# EAGLE design GW-RS485-V40-009 (EAGLE 7.6.0)
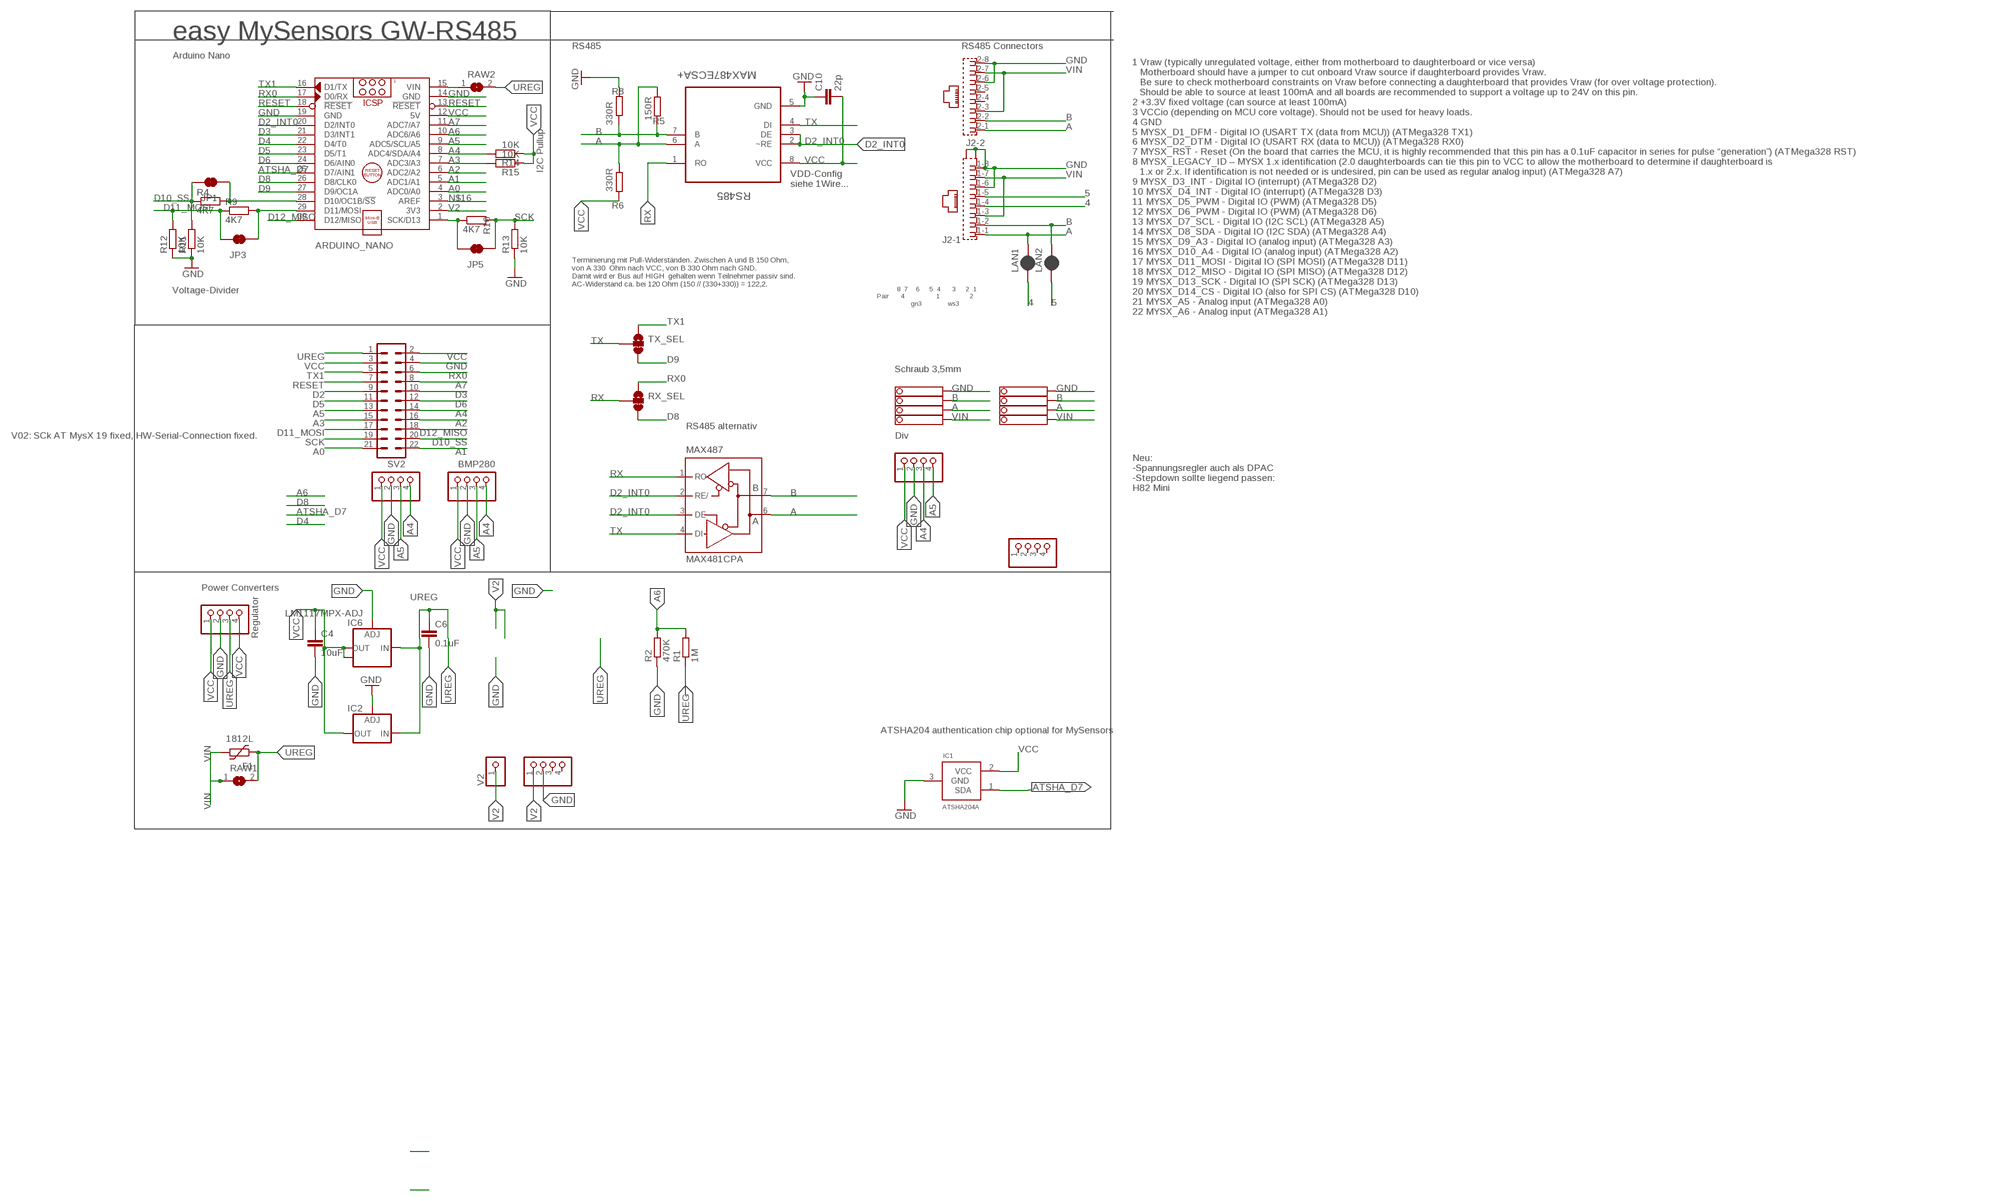
[diagram p0: schematic, sheet 1]

## Parts
ARDUINO_NANO  ARDUINO_NANO_OHNE-BOHR  [ARDUINO_NANO]
BH1750  PINHD-1X04_2.54-S  [1X04-S]
C4  10uF  C-EUC1210  [C1210]
C6  0.1uF  C-EUC1206  [C1206]
C10  22p  C-EUC0805  [C0805]
F1  1812L  [1812L]
I2C-1  PINHD-1X04_2.54-S  [1X04-S]
I2C-2  PINHD-1X04_2.54-S  [1X04-S]
IC1  ATSHA204A  [SOT23]
IC2  LD117ADT50TR  [DPACK]
IC6  LM1117MPX-ADJ  [SOT223]
J2  RJ45_2X_NARROW_SHILDPINS_NOCASE  [RJ45_2X_NARROW_SHILDPINS_NOCASE]
JP1  JUMPER-SMT_2_NC_TRACE_SILK  [SMT-JUMPER_2_NC_TRACE_SILK]
JP2  PINHD-1X04_2.54-S  [1X04-S]
JP3  JUMPER-SMT_2_NC_TRACE_SILK  [SMT-JUMPER_2_NC_TRACE_SILK]
JP5  JUMPER-SMT_2_NC_TRACE_SILK  [SMT-JUMPER_2_NC_TRACE_SILK]
LAN1  JUMPER-SMT_2_NC_PASTE_SILK  [SMT-JUMPER_2_NC_PASTE_SILK]
LAN2  JUMPER-SMT_2_NC_PASTE_SILK  [SMT-JUMPER_2_NC_PASTE_SILK]
MAX487  MAX481CPA  [DIL08]
R1  1M  R-EU_R0805  [R0805]
R2  470K  R-EU_R0805  [R0805]
R4  4K7  R-EU_M0805  [M0805]
R5  150R  R-EU_R0805  [R0805]
R6  330R  R-EU_R0805  [R0805]
R8  330R  R-EU_R0805  [R0805]
R9  4K7  R-EU_M0805  [M0805]
R10  4K7  R-EU_M0805  [M0805]
R11  10K  R-EU_M0805  [M0805]
R12  10K  R-EU_M0805  [M0805]
R13  10K  R-EU_M0805  [M0805]
R14  10K  R-EU_R0805  [R0805]
R15  10K  R-EU_R0805  [R0805]
RAW1  SJ  [SJ]
RAW2  SJ  [SJ]
RS485  MAX487ECSA+  [SOIC127P600X175-8N]
RX_SEL  JUMPER-SMT_3_1-NC_TRACE_SILK  [SMT-JUMPER_3_1-NC_TRACE_SILK]
STEPDWN  PINHD-1X04_2.54-S  [1X04-S]
SV2  MA11-2  [MA11-2]
TX_SEL  JUMPER-SMT_3_1-NC_TRACE_SILK  [SMT-JUMPER_3_1-NC_TRACE_SILK]
V2  PINHD-1X1  [1X01]
V2-  PINHD-1X04_2.54-S  [1X04-S]
X1  1751264  [1751264]
X4  1751264  [1751264]

## Nets
4: J2.1-4 LAN1.1
5: J2.1-5 LAN2.1
A: J2.1-1 J2.2-1 LAN1.2 MAX487.6(A) R5.1 R6.2 RS485.6(A) X1.2 X4.2
A0: ARDUINO_NANO.4(ADC0/A0) SV2.21
A1: ARDUINO_NANO.5(ADC1/A1) SV2.22
A2: ARDUINO_NANO.6(ADC2/A2) SV2.16
A3: ARDUINO_NANO.7(ADC3/A3) R15.2 SV2.15
A4: ARDUINO_NANO.8(ADC4/SDA/A4) BH1750.4 I2C-1.4 I2C-2.3 R14.2 SV2.14
A5: ARDUINO_NANO.9(ADC5/SCL/A5) BH1750.3 I2C-1.3 I2C-2.4 SV2.13
A6: ARDUINO_NANO.10(ADC6/A6) R1.2 R2.2
A7: ARDUINO_NANO.11(ADC7/A7) SV2.8
ATSHA_D7: ARDUINO_NANO.25(D7/AIN1) IC1.1(SDA)
B: J2.1-2 J2.2-2 LAN2.2 MAX487.7(B) R5.2 R8.1 RS485.7(B) X1.3 X4.3
D2: SV2.9
D2_INT0: ARDUINO_NANO.20(D2/INT0) MAX487.2(RE/) MAX487.3(DE) RS485.2(~RE) RS485.3(DE)
D3: ARDUINO_NANO.21(D3/INT1) SV2.10
D4: ARDUINO_NANO.22(D4/T0)
D5: ARDUINO_NANO.23(D5/T1) SV2.11
D6: ARDUINO_NANO.24(D6/AIN0) SV2.12
D8: ARDUINO_NANO.26(D8/CLK0) RX_SEL.3
D9: ARDUINO_NANO.27(D9/OC1A) TX_SEL.3
D10_SS: JP1.1 R4.1 R11.2 SV2.20
D11_MOSI: JP3.1 R9.1 R12.2 SV2.17
D12_MISO: ARDUINO_NANO.30(D12/MISO) SV2.18
GND [Power]: ARDUINO_NANO.14(GND) ARDUINO_NANO.19(GND) BH1750.2 C4.2 C6.2 C10.1 I2C-1.2 I2C-2.2 IC1.3(GND) IC2.1(ADJ) IC6.1(ADJ) J2.1-6 J2.1-8 J2.2-6 J2.2-8 J2.G1(-1:S1) J2.G3(-1:S2) R2.1 R8.2 R11.1 R12.1 R13.1 RS485.5(GND) STEPDWN.2 SV2.4 V2-.2 X1.4 X4.4
N$5: ARDUINO_NANO.1(SCK/D13) JP5.1 R10.1
N$8: ARDUINO_NANO.28(D10/OC1B/!SS) JP1.2 R4.2
N$9: ARDUINO_NANO.29(D11/MOSI) JP3.2 R9.2
N$16: ARDUINO_NANO.3(AREF)
RAW1 [Power]: ARDUINO_NANO.15(VIN) RAW2.1
RESET: ARDUINO_NANO.13(!RESET) ARDUINO_NANO.18(!RESET) SV2.7
RX: MAX487.1(RO) RS485.1(RO) RX_SEL.2
RX0: ARDUINO_NANO.17(D0/RX) RX_SEL.1 SV2.6
SCK: JP5.2 R10.2 R13.2 SV2.19
TX: MAX487.4(DI) RS485.4(DI) TX_SEL.2
TX1: ARDUINO_NANO.16(D1/TX) SV2.5 TX_SEL.1
UREG [Power]: C6.1 F1.P$1 IC2.3(IN) IC6.3(IN) R1.1 RAW1.2 RAW2.2 STEPDWN.3 SV2.1
V2 [Power]: ARDUINO_NANO.2(3V3) V2-.1 V2.1
VCC [Power]: ARDUINO_NANO.12(5V) BH1750.1 C4.1 C10.2 I2C-1.1 I2C-2.1 IC1.2(VCC) IC2.4(OUT) IC6.2(OUT) IC6.TAB(OUT1) R6.1 R14.1 R15.1 RS485.8(VCC) STEPDWN.1 STEPDWN.4 SV2.2 SV2.3
VIN [Power]: F1.P$2 J2.1-3 J2.1-7 J2.2-3 J2.2-7 RAW1.1 X1.1 X4.1
Unconnected: J2.2-4 J2.2-5 JP2.1 JP2.2 JP2.3 JP2.4 V2-.3 V2-.4

## Notes on the sheet
- easy MySensors GW-RS485
- RS485 | RS485 Connectors
- Arduino Nano
- I2C Pullup
- VDD-Config
  siehe 1Wire...
- Voltage-Divider
- Terminierung mit Pull-Widerständen. Zwischen A und B 150 Ohm,
  von A 330  Ohm nach VCC, von B 330 Ohm nach GND. 
  Damit wird er Bus auf HIGH  gehalten wenn Teilnehmer passiv sind.
  AC-Widerstand ca. bei 120 Ohm (150 // (330+330)) = 122,2.
- 8  7    6     5  4      3     2  1
  Pair      4                1               2
                   gn3             ws3
- 1 Vraw (typically unregulated voltage, either from motherboard to daughterboard or vice versa)
     Motherboard should have a jumper to cut onboard Vraw source if daughterboard provides Vraw. 
     Be sure to check motherboard constraints on Vraw before connecting a daughterboard that provides Vraw (for over voltage protection). 
     Should be able to source at least 100mA and all boards are recommended to support a voltage up to 24V on this pin.
  2 +3.3V fixed voltage (can source at least 100mA)
  3 VCCio (depending on MCU core voltage). Should not be used for heavy loads.
  4 GND
  5 MYSX_D1_DFM - Digital IO (USART TX (data from MCU)) (ATMega328 TX1)
  6 MYSX_D2_DTM - Digital IO (USART RX (data to MCU)) (ATMega328 RX0)
  7 MYSX_RST - Reset (On the board that carries the MCU, it is highly recommended that this pin has a 0.1uF capacitor in series for pulse “generation”) (ATMega328 RST)
  8 MYSX_LEGACY_ID – MYSX 1.x identification (2.0 daughterboards can tie this pin to VCC to allow the motherboard to determine if daughterboard is 
     1.x or 2.x. If identification is not needed or is undesired, pin can be used as regular analog input) (ATMega328 A7)
  9 MYSX_D3_INT - Digital IO (interrupt) (ATMega328 D2)
  10 MYSX_D4_INT - Digital IO (interrupt) (ATMega328 D3)
  11 MYSX_D5_PWM - Digital IO (PWM) (ATMega328 D5)
  12 MYSX_D6_PWM - Digital IO (PWM) (ATMega328 D6)
  13 MYSX_D7_SCL - Digital IO (I2C SCL) (ATMega328 A5)
  14 MYSX_D8_SDA - Digital IO (I2C SDA) (ATMega328 A4)
  15 MYSX_D9_A3 - Digital IO (analog input) (ATMega328 A3)
  16 MYSX_D10_A4 - Digital IO (analog input) (ATMega328 A2)
  17 MYSX_D11_MOSI - Digital IO (SPI MOSI) (ATMega328 D11)
  18 MYSX_D12_MISO - Digital IO (SPI MISO) (ATMega328 D12)
  19 MYSX_D13_SCK - Digital IO (SPI SCK) (ATMega328 D13)
  20 MYSX_D14_CS - Digital IO (also for SPI CS) (ATMega328 D10)
  21 MYSX_A5 - Analog input (ATMega328 A0)
  22 MYSX_A6 - Analog input (ATMega328 A1)
- Schraub 3,5mm
- RS485 alternativ
- V02: SCk AT MysX 19 fixed, HW-Serial-Connection fixed. | Div
- BMP280
- Neu:
  -Spannungsregler auch als DPAC
  -Stepdown sollte liegend passen:  
  H82 Mini
- Power Converters
- Regulator
- ATSHA204 authentication chip optional for MySensors

## Power pins joined to a net without a drawn wire
GND: MAX487.5(GND)
VCC: MAX487.8(VCC)

## Library data of the parts
ARDUINO_NANO = ArduinoNanoV30:ARDUINO_NANO_OHNE-BOHR: Arduino Nano V3.0 Module Overview: The Arduino Nano is a small, complete, and breadboard-friendly board based on the ATmega328 (Arduino Nano 3.x) or ATmega168 (Arduino Nano 2.x). It has more or less the same functionality of the Arduino Duemilanove, but in a different package. It lacks only a DC power jack, and works with a Mini-B USB cable instead of a standard one. The Nano was designed and is being produced by Gravitech <http://www.gravitech.us/arna30wiatp.html>. General specifications: Item Value Microcontroller Atmel ATmega168 or ATmega328 Operating Voltage (logic level) 5 V Input Voltage (recommended) 7-12 V Input Voltage (limits) 6-20 V Digital I/O Pins 14 (of which 6 provide PWM output) Analog Input Pins 8 DC Current per I/O Pin 40 mA Flash Memory 16 KB (ATmega168) or 32 KB (ATmega328) of which 2 KB used by bootloader SRAM 1 KB (ATmega168) or 2 KB (ATmega328) EEPROM 512 bytes (ATmega168) or 1 KB (ATmega328) Clock Speed 16 MHz Dimensions (Inches) 0.73" x 1.70" Dimensions (mm) 18mm x 45mm Overall height About 9 mm (not including pins) Weigth 5 g Power: The Arduino Nano can be powered via the Mini-B USB connection, 6-20V unregulated external power supply (pin 30), or 5V regulated external power supply (pin 27). The power source is automatically selected to the highest voltage source. Memory: The ATmega168 has 16 KB of flash memory for storing code (of which 2 KB is used for the bootloader); the ATmega328 has 32 KB, (also with 2 KB used for the bootloader). The ATmega168 has 1 KB of SRAM and 512 bytes of EEPROM (which can be read and written with the EEPROM library); the ATmega328 has 2 KB of SRAM and 1 KB of EEPROM. Input and Output: Each of the 14 digital pins on the Nano can be used as an input or output, using pinMode(), digitalWrite(), and digitalRead() functions. They operate at 5 volts. Each pin can provide or receive a maximum of 40 mA and has an internal pull-up resistor (disconnected by default) of 20-50 kOhms. In addition, some pins have specialized functions. Visit Arduino - ArduinoBoardNano <https://www.arduino.cc/en/Main/ArduinoBoardNano>
BH1750 I2C-1 I2C-2 JP2 STEPDWN V2- = pinhead-2:PINHD-1X04: PIN HEADER
C4 C6 C10 = rcl:C-EU: CAPACITOR, European symbol
F1 = ptc-littlefuse:1812L
IC1 = Sensor:ATSHA204A
IC2 = v-reg:LD117A?*: Low drop fixed and adjustable positive voltage regulators 1 A Source: http://www.st.com/stonline/products/literature/ds/7194/ld1117axx.pdf
IC6 = lm1117:LM1117MPX-ADJ
J2 = RJ45:RJ45_2X_NARROW_SHILDPINS_NOCASE: RJ45 connector
JP1 JP3 JP5 = SparkFun-Jumpers:JUMPER-SMT_2_NC_TRACE: Normally closed trace jumper This jumper has a trace between two pads so it's normally closed (NC). Use a razor knife to open the connection. For best results follow the IPC guidelines for cutting traces: Cutout at least 0.063 mm (0.005 in). Remove all loose material to clean up the cut area. Seal the cut with an approved epoxy. Reapply solder to reclose the connection.
LAN1 LAN2 = SparkFun-Jumpers:JUMPER-SMT_2_NC_PASTE: Normally closed solder jumper This jumper has an aperture in the stencil to allow solder paste to bridge the split in the wire so it's normally closed (NC). Wick off the solder to open the connection. Reapply solder to reclose the connection.
MAX487 = maxim-4:MAX481CPA: RS485 TRANSEIVER
R1 R2 R4-R6 R8-R15 = rcl:R-EU_: RESISTOR, European symbol
RAW1 RAW2 = jumper:SJ: SMD solder JUMPER
RS485 = Maxim_By_element14_Batch_1:MAX487ECSA+: Low-Power, Slew-Rate-Limited RS-485/RS-422 Transceivers; MPN: MAX487ECSA+; OC_FARNELL: 9724532; OC_NEWARK: 68K4803; PACKAGE: SOIC-8; SUPPLIER: Maxim
RX_SEL TX_SEL = SparkFun-Jumpers:JUMPER-SMT_3_1-NC_TRACE: Normally closed trace jumper (1 of 2 connections) This jumper has a trace between two pads so it's normally closed (NC). The other connection is normally open (NO). Use a razor knife to open the connection. For best results follow the IPC guidelines for cutting traces: Cutout at least 0.063 mm (0.005 in). Remove all loose material to clean up the cut area. Seal the cut with an approved epoxy. Reapply solder to reclose the connection, or to close the NO connection.
SV2 = con-Pinheader:MA11-2: PIN HEADER; OC_FARNELL: unknown; OC_NEWARK: unknown
V2 = pinhead:PINHD-1X1: PIN HEADER
X1 X4 = con-phoenix-350:1751264: MKDS 1/ 4-3,5 Printklemme Nennstrom: 10 A Bemessungsspannung: 160 V Raster: 3,5 mm Polzahl: 4 Montageart: Löten Anschlussart: Schraubanschluss Anschlussrichtung vom Leiter zur Platine: 0° Source: http://eshop.phoenixcontact.com .. 1751264.pdf; MPN: 1751264; OC_FARNELL: unknown; OC_NEWARK: 10R0934

## Net classes
0 default: width 0.305 mm
1 Power: width 0.508 mm

## Board
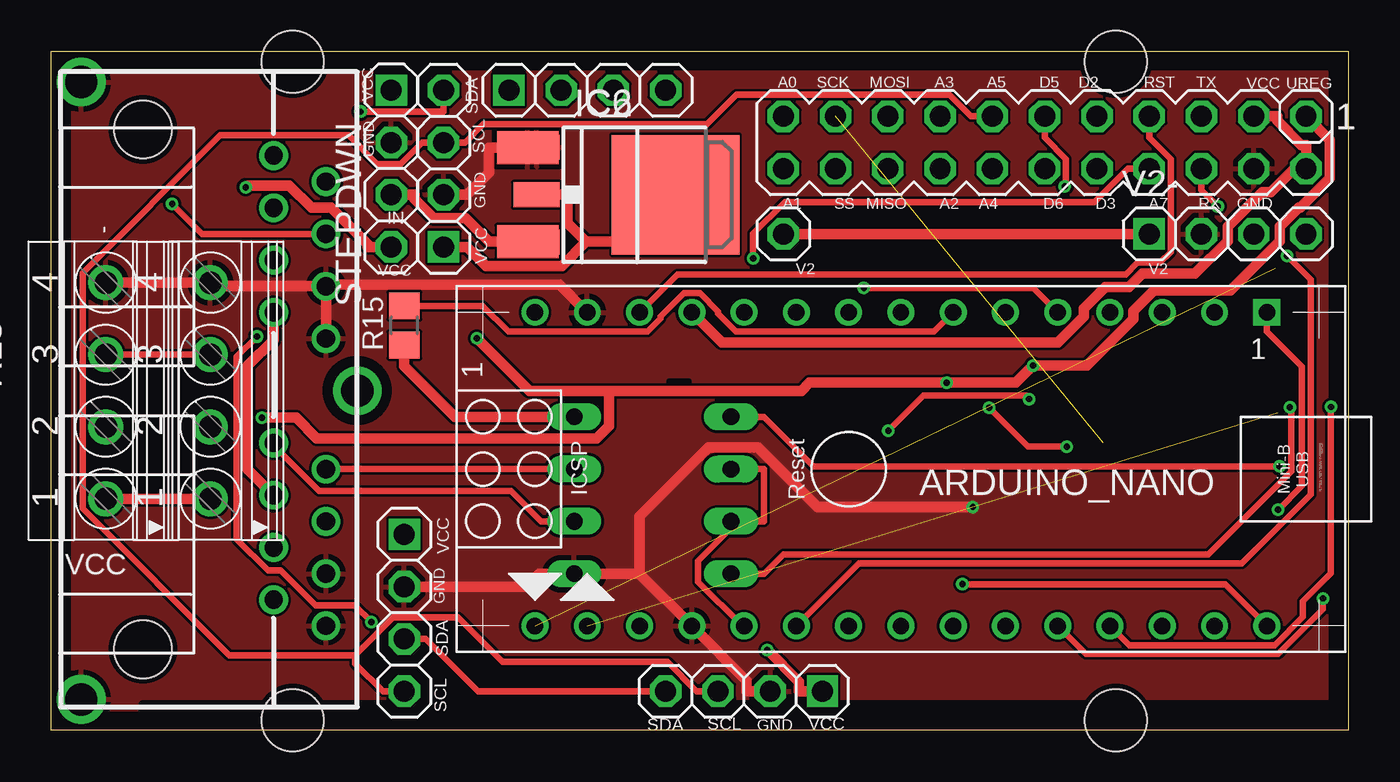
[diagram p1: board, top side]
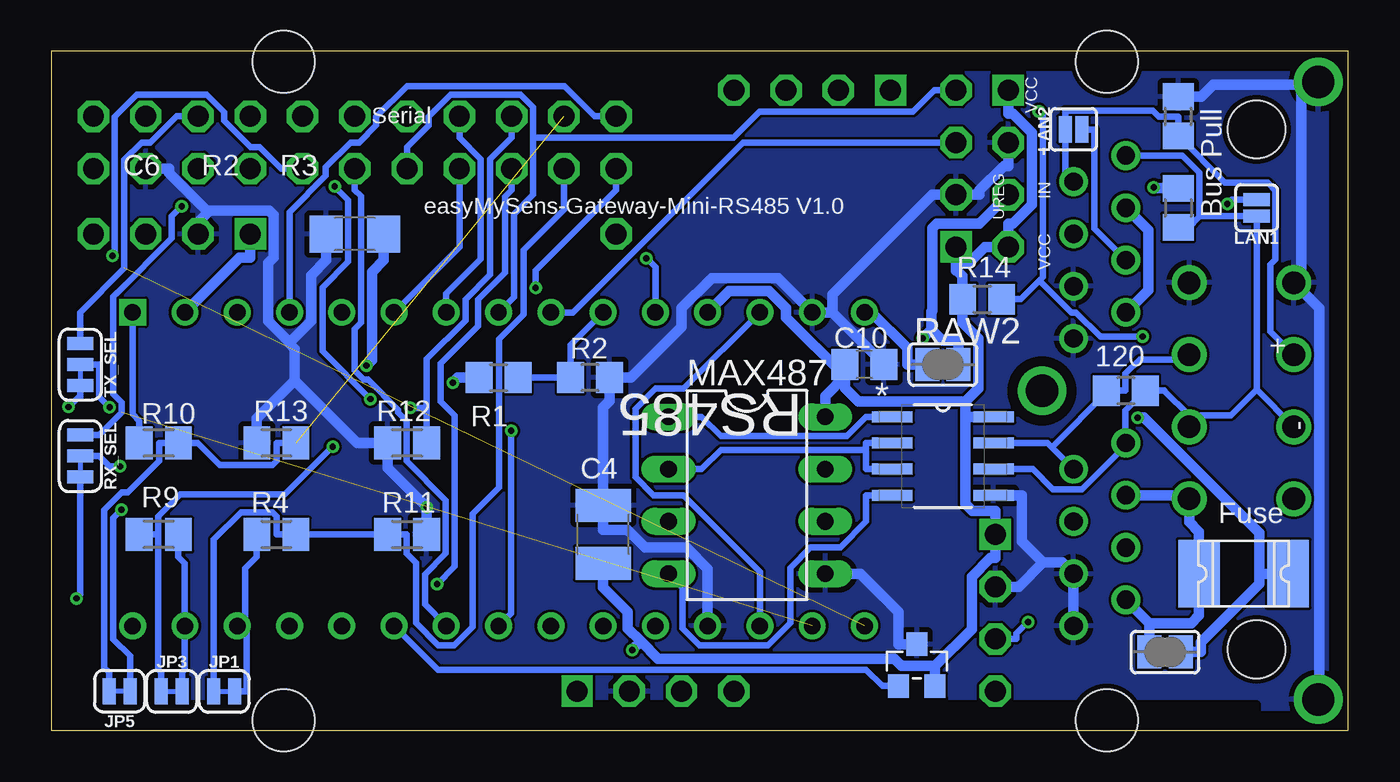
[diagram p2: board, bottom side, seen from below]

Size 63 x 33 mm. Coordinates in mm from the lower left corner, seen from the top.
Outline: 63,0 0,0 0,33 63,33 63,0
Copper layers (1*16): Top 0.035mm / dielectric 1.5mm / Bottom 0.035mm
Design rules "dirt_cheap_dirty_boards.v1": minimum track width 5mil, minimum drill 12mil, track to track 5mil, track to pad 5mil, pad to pad 5mil, via to via 5mil, smd to smd 0mil, copper to edge 10mil, drill to drill 10mil, minimum pad ring 10mil, minimum via ring 6mil, stop-mask expansion 2mil, vias tented up to drill 25mil, thermal gap 10mil
Holes 3 mm at 11.72,32.5 11.72,0.5 51.72,32.5 51.72,0.5
tRestrict: area 3.8,32.4 to 62.9,33; area 4.4,0 to 62.9,1.3; area 13.3,14.9 to 16.5,18.1; 1 lines
bRestrict: area 3.8,32.4 to 62.9,33; area 4.4,0 to 62.9,1.3; area 13.3,14.9 to 16.5,18.1; 1 lines

### Footprints (pad centres in the part's own frame; a part is rotated, then mirrored left to right if it is on the bottom)
ARDUINO_NANO = drill 0.8 square: 1 -20.32,-7.62 | drill 0.8: 2 -17.78,-7.62; 3 -15.24,-7.62; 4 -12.7,-7.62; 5 -10.16,-7.62; 6 -7.62,-7.62; 7 -5.08,-7.62; 8 -2.54,-7.62; 9 0,-7.62; 10 2.54,-7.62; 11 5.08,-7.62; 12 7.62,-7.62; 13 10.16,-7.62; 14 12.7,-7.62; 15 15.24,-7.62; 16 15.24,7.62; 17 12.7,7.62; 18 10.16,7.62; 19 7.62,7.62; 20 5.08,7.62; 21 2.54,7.62; 22 0,7.62; 23 -2.54,7.62; 24 -5.08,7.62; 25 -7.62,7.62; 26 -10.16,7.62; 27 -12.7,7.62; 28 -15.24,7.62; 29 -17.78,7.62; 30 -20.32,7.62
1X04-S = drill 1.016 square: 1 -3.81,0 | drill 1.016 octagon: 2 -1.27,0; 3 1.27,0; 4 3.81,0
C1210 = smd 1.6 x 2.7: 1 -1.4,0; 2 1.4,0
C1206 = smd 1.6 x 1.8: 1 -1.4,0; 2 1.4,0
C0805 = smd 1.3 x 1.5: 1 -0.95,0; 2 0.95,0
1812L = smd 2.03 x 3.3: P$1 -2.16,0; P$2 2.16,0
SOT23 = smd 1.016 x 1.143: 1 -0.889,-1.016; 2 0.889,-1.016; 3 0,1.016
DPACK = smd 1.6 x 3: 1 -2.28,-4.8; 3 2.28,-4.8 | smd 5.8 x 6.2: 4 0,2.38
SOT223 = smd 1.219 x 2.235: 1 -2.311,-3.099; 2 0,-3.099; 3 2.311,-3.099 | smd 3.6 x 2.2: TAB 0,3.099
RJ45_2X_NARROW_SHILDPINS_NOCASE = drill 0.889: 1-1 -11.43,6.35; 1-2 -10.16,8.89; 1-3 -8.89,6.35; 1-4 -7.62,8.89; 1-5 -6.35,6.35; 1-6 -5.08,8.89; 1-7 -3.81,6.35; 1-8 -2.54,8.89; 2-1 2.54,6.35; 2-2 3.81,8.89; 2-3 5.08,6.35; 2-4 6.35,8.89; 2-5 7.62,6.35; 2-6 8.89,8.89; 2-7 10.16,6.35; 2-8 11.43,8.89 | drill 1.575 pad 2.184: G1 -15,-3; G2 0,10.414; G3 15,-3 | hole 2.8: -12.7,0; 12.573,0
SMT-JUMPER_2_NC_TRACE_SILK = smd 0.635 x 1.27: 1 -0.508,0; 2 0.508,0
SMT-JUMPER_2_NC_PASTE_SILK = smd 0.635 x 1.27: 1 -0.406,0; 2 0.406,0
DIL08 = drill 0.813 long: 1 -3.81,-3.81; 2 -1.27,-3.81; 3 1.27,-3.81; 4 3.81,-3.81; 5 3.81,3.81; 6 1.27,3.81; 7 -1.27,3.81; 8 -3.81,3.81
R0805 = smd 1.3 x 1.5: 1 -0.95,0; 2 0.95,0
M0805 = smd 1.3 x 1.6: 1 -0.95,0; 2 0.95,0
SJ = smd 1.168 x 1.6: 1 -0.762,0; 2 0.762,0
SOIC127P600X175-8N = smd 1.981 x 0.533: 1 -2.464,1.905; 2 -2.464,0.635; 3 -2.464,-0.635; 4 -2.464,-1.905; 5 2.464,-1.905; 6 2.464,-0.635; 7 2.464,0.635; 8 2.464,1.905
SMT-JUMPER_3_1-NC_TRACE_SILK = smd 0.635 x 1.27: 1 -1.016,0; 2 0,0; 3 1.016,0
MA11-2 = drill 1.016 octagon: 1 -12.7,-1.27; 2 -12.7,1.27; 3 -10.16,-1.27; 4 -10.16,1.27; 5 -7.62,-1.27; 6 -7.62,1.27; 7 -5.08,-1.27; 8 -5.08,1.27; 9 -2.54,-1.27; 10 -2.54,1.27; 11 0,-1.27; 12 0,1.27; 13 2.54,-1.27; 14 2.54,1.27; 15 5.08,-1.27; 16 5.08,1.27; 17 7.62,-1.27; 18 7.62,1.27; 19 10.16,-1.27; 20 10.16,1.27; 21 12.7,-1.27; 22 12.7,1.27
1X01 = drill 1.016 octagon: 1 0,0
1751264 = drill 1.1 pad 1.7: 1 -5.25,-0.1; 2 -1.75,-0.1; 3 1.75,-0.1; 4 5.25,-0.1

### Placement (x,y rotation side)
ARDUINO_NANO  38.73,12.7 180 top
BH1750  19.05,27.3 90 top
C4  36.2,9.53 90 bottom
C6  48.26,24.13 180 bottom
C10  23.5,17.78 180 bottom
F1  5.08,7.62 180 bottom
I2C-1  33.66,1.91 180 top
I2C-2  17.14,5.71 270 top
IC1  20.95,3.17 0 bottom
IC2  27.94,26.04 270 top
IC6  26.67,26.04 270 top
J2  4.45,16.51 270 top
JP1  54.61,1.91 0 bottom
JP2  26.04,31.11 0 top
JP3  57.15,1.91 0 bottom
JP5  59.69,1.91 180 bottom
LAN1  4.45,25.4 270 bottom
LAN2  13.34,29.21 180 bottom
MAX487  29.21,11.43 270 bottom
R1  41.27,17.14 0 bottom
R2  36.83,17.14 180 bottom
R4  52.07,9.53 180 bottom
R5  10.79,16.51 180 bottom
R6  8.26,25.4 270 bottom
R8  8.26,29.84 90 bottom
R9  57.78,9.53 0 bottom
R10  57.78,13.97 0 bottom
R11  45.72,9.53 180 bottom
R12  45.72,13.97 0 bottom
R13  52.07,13.97 0 bottom
R14  17.78,20.95 0 bottom
R15  17.14,19.68 90 top
RAW1  8.89,3.81 0 bottom
RAW2  19.68,17.78 0 bottom
RS485  19.68,13.34 0 bottom
RX_SEL  61.59,13.34 270 bottom
STEPDWN  16.51,27.3 270 top
SV2  48.26,28.57 180 top
TX_SEL  61.59,17.78 270 bottom
V2  35.56,24.13 0 top
V2-  57.15,24.13 0 top
X1  2.54,16.51 90 top
X4  7.62,16.51 90 top

### Tracks (layer width: path | path; a pad name or v marks a point on that pad's centre or on a via)
4  (via drill 0.3 pad 0.61)
  Top 0.305: J2.1-4 7.32,24.13 v5.86,25.59
  Bottom 0.305: v5.86,25.59 5.64,25.81 5.36,25.81 LAN1.1
5
  Bottom 0.305: LAN2.1 12.33,29.21 12.33,24.4 J2.1-5
A
  Top 0.305: MAX487.6 23.8,10.16 22.33,11.63 13.02,11.63 10.79,13.86 J2.2-1
  Bottom 0.305: RS485.6 15.31,12.7 14.34,11.72 12.93,11.72 10.79,13.86 J2.2-1 10.82,13.99 10.82,15.54 R5.1 8.92,16.51 7.72,15.31 | 7.72,15.31 5.7,15.31 4.45,16.57 | X4.2 7.72,15.31 | 4.45,16.57 LAN1.2 5.36,24.99 7.23,24.99 | X1.2 4.45,16.57 | 7.23,24.99 7.23,27.12 8.05,27.94 J2.1-1 | 7.23,24.99 7.23,24.96 7.74,24.45 R6.2
A0
  Bottom 0.305: SV2.21 36.6,29.84 38.08,31.32 45.72,31.32 47.22,29.82 47.22,29.41 48.06,28.57 48.47,28.57 49.67,27.37 49.67,26.96 51.44,25.2 ARDUINO_NANO.4
A1  (via drill 0.3 pad 0.61)
  Top 0.305: v39.48,21.51 47.71,21.51 ARDUINO_NANO.5
  Bottom 0.305: SV2.22 35.56,26.26 39.48,22.35 v39.48,21.51
A2
  Bottom 0.305: ARDUINO_NANO.6 43.18,23.5 43.18,26.26 SV2.16
A3
  Top 0.305: ARDUINO_NANO.7 42.88,19.39 33.27,19.39 32.39,20.27 32.39,20.37 31.5,21.26 30.73,21.26 29.59,20.12 29.59,20.01 28.97,19.39 22.2,19.39 20.95,20.64 R15.2
  Bottom 0.305: ARDUINO_NANO.7 43.81,21.24 42.14,22.91 42.14,27.76 43.18,28.8 SV2.15
A4  (via drill 0.3 pad 0.61)
  Top 0.305: v9.98,19.14 9.01,18.17 9.01,9.29 10.53,7.77 11.13,7.77 12.83,6.08 14.73,6.08 v15.54,5.27 | v15.02,30.07 19.05,30.07 BH1750.4 | I2C-1.4 20.73,1.91 18.19,4.45 I2C-2.3
  Bottom 0.305: 39.6,28.8 39.6,26.04 40.53,25.1 40.53,21.06 ARDUINO_NANO.8 | 39.6,28.8 39.6,30.28 40.2,30.89 43.62,30.89 44.68,29.82 44.68,29.39 45.72,28.35 SV2.14 | 39.6,28.8 29.86,28.8 28.59,30.07 21.13,30.07 20.09,31.11 BH1750.4 | 14.99,21.86 14.83,22.03 14.83,29.88 v15.02,30.07 | 14.99,21.86 15.9,20.95 R14.2 | 14.99,21.86 13.45,20.32 13.22,20.32 12.04,19.14 v9.98,19.14 | I2C-2.3 16.1,4.45 16.1,4.71 v15.54,5.27
A5
  Top 0.305: 14.76,3.66 16.59,5.49 19.76,5.49 21.93,3.32 29.93,3.32 31.34,1.91 I2C-1.3 | 14.76,3.66 8.64,3.66 1.51,10.79 1.51,22.23 8.2,28.92 14.43,28.92 15.82,27.53 16.96,27.53 18.01,28.57 BH1750.3 20.09,28.57 20.98,29.46 31.86,29.46 33.29,30.89 43.64,30.89 44.68,29.84 SV2.13 | 14.76,3.66 14.76,3.25 16.1,1.91 I2C-2.4
  Bottom 0.305: BH1750.3 29.4,28.57 37.66,20.32 ARDUINO_NANO.9
A6
  Bottom 0.305: R1.2 39.4,17.14 R2.2 37.78,18.73 ARDUINO_NANO.10
A7  (via drill 0.3 pad 0.61)
  Top 0.305: SV2.8 52.3,27.3 50.68,25.68 35.64,25.68 34.1,24.14 v34.1,22.95
  Bottom 0.305: v34.1,22.95 33.66,22.51 ARDUINO_NANO.11
ATSHA_D7
  Bottom 0.305: IC1.1 22.63,2.16 23.42,2.95 44.22,2.95 ARDUINO_NANO.25
B
  Top 0.305: MAX487.7 J2.2-2 | X4.3 X1.3
  Bottom 0.305: X1.3 3.77,19.39 3.77,22.65 3.53,22.89 3.53,26.25 3.91,26.62 5.98,26.62 R8.1 8.26,29.82 9.18,29.82 9.48,30.12 13.74,30.12 LAN2.2 13.74,27.08 J2.1-2 | X4.3 7.95,18.03 10.12,18.03 10.82,17.34 10.82,16.51 11.64,16.51 | 14.39,13.76 J2.2-2 | RS485.7 14.61,13.97 14.39,13.76 | 11.64,16.51 14.39,13.76 | R5.2 11.64,16.51
D2_INT0
  Top 0.305: 33.34,10.16 31.42,8.24 31.42,7.23 33.56,5.08 ARDUINO_NANO.20 | 33.34,10.16 34.62,10.16 34.62,12.7 MAX487.2 | MAX487.3 33.34,10.16
  Bottom 0.305: 23.42,13.64 23.42,13.97 RS485.2 | 23.42,13.64 23.42,12.7 RS485.3 | 23.42,13.64 30.48,13.64 31.42,12.7 MAX487.2
D3  (via drill 0.3 pad 0.61)
  Top 0.305: v60.04,23.06 61.19,21.91 61.19,11.48 57.84,8.13 39.24,8.13 ARDUINO_NANO.21
  Bottom 0.305: SV2.10 51.84,27.3 52.88,28.35 53.32,28.35 54.61,29.64 54.61,30.05 55.45,30.89 58.86,30.89 59.92,29.82 59.92,23.18 v60.04,23.06
D5  (via drill 0.3 pad 0.61)
  Top 0.305: v47.51,16.1 47.34,16.27 42.37,16.27 v40.67,14.57 | SV2.11 48.26,28.8 49.3,27.76 49.3,26.5 v49.24,26.44
  Bottom 0.305: ARDUINO_NANO.23 40.67,5.69 v40.67,14.57 | v49.24,26.44 48.58,25.78 48.58,22.78 49.84,21.53 49.84,18.43 v47.51,16.1
D6
  Bottom 0.305: ARDUINO_NANO.24 44.85,6.12 44.85,7.6 43.84,8.61 43.84,11.19 45.74,13.09 45.74,15.03 46.15,15.44 46.15,15.58 47.62,17.05 47.84,17.05 48.28,17.49 48.28,19.5 47.96,19.82 47.96,25.96 48.26,26.26 SV2.12
D8  (via drill 0.3 pad 0.61)
  Top 0.305: v61.78,6.41 61.78,5.87 59.62,3.71 50.26,3.71 ARDUINO_NANO.26
  Bottom 0.305: RX_SEL.3 61.59,6.6 v61.78,6.41
D9  (via drill 0.3 pad 0.61)
  Top 0.305: v62.17,15.72 62.17,7.62 60.81,6.26 60.81,5.51 59.44,4.14 52.37,4.14 ARDUINO_NANO.27
  Bottom 0.305: TX_SEL.3 61.59,16.17 61.73,16.17 v62.17,15.72
D10_SS
  Bottom 0.305: SV2.20 38.1,25.3 40.06,23.34 40.06,20.21 41.25,19.02 41.25,11.81 42.55,10.52 42.55,5.03 43.43,4.14 44.2,4.14 45.29,5.22 45.29,8.14 45.74,8.6 45.74,9.53 R11.2 50.19,9.53 R4.1 52.05,9.53 52.05,10.4 52.25,10.6 53.79,10.6 55.12,9.27 JP1.1
D11_MOSI  (via drill 0.3 pad 0.61)
  Top 0.305: v45.56,15.68 47.45,13.79 v49.33,13.79
  Bottom 0.305: 44.77,15.68 44.77,18.04 42.88,19.93 42.88,20.95 41.68,22.15 41.68,27.76 40.64,28.8 SV2.17 | R12.2 44.77,15.68 | 44.77,15.68 v45.56,15.68 | v49.33,13.79 51.67,11.46 56.75,11.46 57.81,10.4 57.81,9.53 | R9.1 57.81,9.53 | JP3.1 57.66,2.82 57.81,2.97 57.81,9.53
D12_MISO  (via drill 0.3 pad 0.61)
  Top 0.305: ARDUINO_NANO.30 57.03,7.11 v44.26,7.11
  Bottom 0.305: v44.26,7.11 43.41,7.96 43.41,15.3 44.09,15.98 44.09,17.84 42.27,19.66 42.27,20.95 40.96,22.25 40.96,25.94 40.64,26.26 SV2.18
GND  (via drill 0.3 pad 0.61)
  Top 0.508: 28.57,7.62 28.57,10.39 31.93,13.74 34.34,13.74 37.22,10.86 v44.77,10.86 | 28.57,7.62 MAX487.5 23.7,7.62 23.06,6.99 I2C-2.2 | 28.57,7.62 ARDUINO_NANO.19 33.78,2.41 33.78,1.91 I2C-1.2 | J2.1-6 13.41,21.67 24.69,21.67 ARDUINO_NANO.14 | J2.1-8 J2.1-6 | IC6.1 23.17,28.35 IC2.1 21.26,28.32 21.26,27.1 20.19,26.04 BH1750.2 | J2.1-6 7.89,21.59 X4.4 X1.4
  Bottom 0.508: ARDUINO_NANO.19 31.11,7.85 32.15,8.89 34.16,8.89 35.01,9.74 36.2,9.74 C4.2 36.2,15.7 35.88,16.01 R2.1 34.85,17.14 32.38,19.61 32.38,20.52 30.91,22 27.71,22 ARDUINO_NANO.14 25.05,20.32 | 55.39,25.19 55.31,25.27 52.42,25.27 52.2,25.05 52.2,22.99 52.47,22.71 52.47,19.89 51.43,18.85 | 55.39,25.19 55.88,24.7 V2-.2 | 55.39,25.19 57.28,27.08 57.28,27.3 SV2.4 | R11.1 v44.77,10.86 46.67,12.76 46.67,12.79 R12.1 47.7,13.97 48.14,13.97 51.17,17 | 51.17,17 53.02,15.15 R13.1 | 51.17,17 51.17,18.53 51.43,18.79 51.43,18.85 | 51.43,18.85 | IC1.3 21.84,4.19 21.84,5.77 23.7,7.62 MAX487.5 | 25.05,20.32 25.05,21.18 20.19,26.04 BH1750.2 17.91,26.04 17.91,26.26 16.73,27.43 16.51,27.43 STEPDWN.2 | C10.1 22.55,17.82 25.05,20.32 | 51.43,18.85 50.39,19.89 50.39,22.11 49.66,22.85 C6.2 | 14.83,8.16 16,6.99 I2C-2.2 | 14.83,8.16 13.88,8.16 J2.2-6 J2.2-8 | 14.83,8.16 15.85,9.18 15.85,11.43 RS485.5 | 2.28,31.38 2.28,22.12 X1.4 1.41,20.53 1.41,1.55 J2.G3 | J2.G1 2.15,31.51 2.28,31.38 | 2.28,31.38 6.54,31.38 7.12,30.8 R8.2
  pour Bottom: 1,32 1,1 62,1 62,32
  pour Top: 1,1 62,1 62,32 1,32
N$5  (via drill 0.3 pad 0.61)
  Top 0.305: v59.6,10.72 60.76,11.88 60.76,17.68 59.05,19.39 ARDUINO_NANO.1
  Bottom 0.305: v59.6,10.72 59.99,10.33 59.99,4.43 59.18,3.62 JP5.1 | R10.1 58.73,15.05 59.05,15.37 ARDUINO_NANO.1
N$8
  Bottom 0.305: 53.59,5.08 53.59,7.87 53.02,8.45 R4.2 | 53.59,5.08 53.51,4.99 53.51,1.91 JP1.2 | 53.59,5.08 ARDUINO_NANO.28
N$9
  Bottom 0.305: R9.2 56.84,8.45 56.52,8.13 ARDUINO_NANO.29 56.52,2.95 56.64,2.82 JP3.2
RAW1
  Bottom 0.508: RAW2.1 21.41,17.78 21.41,18.59 23.15,20.32 ARDUINO_NANO.15
RESET
  Top 0.305: ARDUINO_NANO.13 30.42,22.16 52.21,22.16 52.77,22.73 53.86,22.73 54.38,23.25 54.38,27.76 53.34,28.8 SV2.7
  Bottom 0.305: ARDUINO_NANO.13 32.28,16.61 33.64,16.61 34.62,15.63 34.62,12.31 33.74,11.43 32.3,11.43 28.57,7.71 ARDUINO_NANO.18
RX  (via drill 0.3 pad 0.61)
  Top 0.305: v59.66,12.83 37.03,12.83 34.62,15.24 MAX487.1
  Bottom 0.305: v59.66,12.83 60.18,12.83 60.68,13.34 RX_SEL.2 | MAX487.1 31.42,15.24 30.48,14.3 24.35,14.3 23.42,15.23 23.42,15.24 RS485.1
RX0  (via drill 0.3 pad 0.61)  (1 unrouted)
  Top 0.305: v56.67,25.47 55.88,26.26 SV2.6
  Bottom 0.305: v56.67,25.47 57.15,24.99 57.15,23.92 59.81,21.27 59.82,21.27 59.99,21.09 59.99,16.35 59.59,15.95 59.59,15.44 60.68,14.35 RX_SEL.1
SCK  (1 unrouted)
  Bottom 0.305: R13.2 52.05,13.97 52.05,13.09 52.25,12.89 54.83,12.89 55.91,13.97 R10.2 57.76,13.97 57.76,13.1 59.29,11.57 59.58,11.57 60.43,10.73 60.43,3.05 60.2,2.82 JP5.2
TX  (via drill 0.3 pad 0.61)
  Top 0.305: v60.17,15.71 60.25,15.63 60.25,12.59 56.22,8.56 35.56,8.56 | 35.56,8.56 | 35.56,8.56 34.62,7.62 MAX487.4
  Bottom 0.305: v60.17,15.71 60.68,16.21 60.68,17.78 TX_SEL.2 | RS485.4 23.42,11.43 23.42,10.15 24.68,8.89 26.12,8.89 27.1,7.91 27.1,5.23 28.19,4.15 31.5,4.15 32.33,4.97 32.33,6.93 MAX487.4
TX1  (1 unrouted)
  Bottom 0.305: 61.59,19.39 61.59,20.32 59.45,22.46 59.45,23.3 59.46,23.31 59.46,27.74 58.62,28.57 58.19,28.57 56.92,29.84 SV2.5 | 61.59,19.39 | TX_SEL.1 61.59,19.39
UREG  (via drill 0.3 pad 0.61)
  Top 0.508: SV2.1 62.11,28.7 62.11,26.83 60.68,25.4 60.61,25.4 59.69,24.48 59.69,23.78 57.28,21.37 53.56,21.37 52.58,20.39 52.58,19.99 50.32,17.73 v47.69,17.73 46.86,16.9 v43.5,16.9 36.84,16.9 36.43,16.49 27.1,16.49 | 27.1,16.49 27.1,14.81 26.49,14.19 12.89,14.19 11.88,15.2 v10.23,15.2 | v20.67,19.05 23.23,16.49 27.1,16.49 | STEPDWN.3 17.65,26.04 17.65,25.81 18.57,24.89 20.12,24.89 21.26,23.75 IC2.3 23.17,23.72 IC6.3
  Bottom 0.508: C6.1 46.86,22.85 47.43,22.28 47.43,18 v47.69,17.73 | R1.1 43.26,17.14 v43.5,16.9 | v10.23,15.2 9.91,15.2 4.32,9.6 4.32,7.62 | RAW2.2 18.92,18.96 19.7,18.96 20.23,19.49 | STEPDWN.3 17.91,24.64 19.97,24.64 20.2,24.41 20.2,20.39 20.23,20.36 20.23,19.49 | 20.23,19.49 v20.67,19.05 | 4.32,7.62 4.31,7.62 4.15,7.62 F1.P$1 | RAW1.2 7.16,3.81 7.16,4.28 4.32,7.13 4.32,7.62
V2
  Top 0.508: V2.1 36.7,24.13 52.2,24.13 V2-.1
  Bottom 0.508: V2-.1 53.34,22.99 53.85,22.99 ARDUINO_NANO.2
VCC  (via drill 0.3 pad 0.61)
  Top 0.508: 60.96,27.88 59.24,26.16 58.83,26.16 57.15,24.48 57.15,23.78 55.56,22.19 52.99,22.19 52.36,21.56 51.21,21.56 50.16,20.52 50.16,20.12 48.89,18.85 32.58,18.85 ARDUINO_NANO.12 | 60.96,27.88 60.96,28.45 60.74,28.45 59.56,29.62 59.56,29.84 SV2.3 | SV2.2 60.96,27.88 | I2C-1.1 36.32,1.91 36.32,2.37 v34.78,3.91 | R15.1 17.14,17.7 19.61,15.24 23.7,15.24 MAX487.8 | STEPDWN.4 15.37,23.5 15.37,23.63 13.6,25.4 12.64,25.4 11.56,26.48 9.52,26.48 v9.44,26.4 | IC6.2 25.07,26.04 25.07,24.66 25.98,23.75 | 25.98,23.75 29.67,23.75 29.77,23.85 IC6.TAB IC2.4 | 25.98,23.75 24.8,22.57 21.11,22.57 20.19,23.5 BH1750.1
  Bottom 0.508: 18.59,15.24 18.59,11 18.26,10.67 17.14,10.67 I2C-2.1 17.14,8.38 17.37,8.38 18.29,7.46 18.29,4.92 20.07,3.14 | 18.59,15.98 18.59,15.24 | 18.59,15.98 17.95,16.62 17.95,19.05 18.73,19.82 R14.1 18.73,22.09 19,22.35 19.05,22.35 19.05,22.7 | 18.59,15.98 23.78,15.98 24.45,16.65 24.45,17.21 | RS485.8 18.59,15.24 | 20.07,3.14 21.69,3.14 22.03,3.48 33.52,3.48 34.37,4.32 | 20.07,3.14 20.07,3.11 IC1.2 | 34.37,4.32 35.01,4.97 35.01,5.76 36.2,6.94 C4.1 | v34.78,3.91 34.37,4.32 | 19.05,22.7 18.45,22.7 17.65,23.5 STEPDWN.4 16.51,24.64 16.29,24.64 15.36,25.56 15.36,29.05 16.29,29.97 16.51,29.97 STEPDWN.1 | BH1750.1 19.05,22.7 | R6.1 9.39,26.35 v9.44,26.4 | ARDUINO_NANO.12 30.08,21.36 28.14,21.36 27.3,20.52 27.3,20.07 24.45,17.21 | 24.45,17.21 25.4,16.26 MAX487.8 | C10.2 24.45,17.21
VIN
  Top 0.508: J2.2-3 9.55,12.68 9.55,17.73 10.79,18.98 J2.1-7 | X4.1 X1.1
  Bottom 0.508: J2.2-3 7.89,11.43 X4.1 7.72,10.13 7.24,9.65 F1.P$2 7.24,5.59 7.62,5.21 9.65,5.21 | J2.1-7 9.71,21.4 9.71,24.32 J2.1-3 | 9.65,5.21 J2.2-7 | RAW1.1 9.65,5.21

### Text on the board
tPlace: VCC | UREG | VCC | A0 | SCK | MOSI | A3 | A5 | D5 | D2 | RST | TX | GND | A1 | SS | MISO | A2 | A4 | D6 | D3 | A7 | RX | GND | GND | V2 | V2 | VCC | R15 | GND | GND
bPlace: UREG | easyMySens-Gateway-Mini-RS485 V1.0
tNames: SDA | SCL | IN | - | VCC | VCC | VCC | SDA | SCL | SDA | SCL | VCC
bNames: VCC | Serial | - | IN | R3 | R2 | C6 | Bus Pull | VCC | R14 | + | C10 | 120 | R2 | - | R1 | R12 | R13 | R10 | C4 | R11 | R4 | R9 | Fuse
tValues: Gehäuse: RND 455‑00307